# EAGLE design sandwich-logger (EAGLE 6.4)
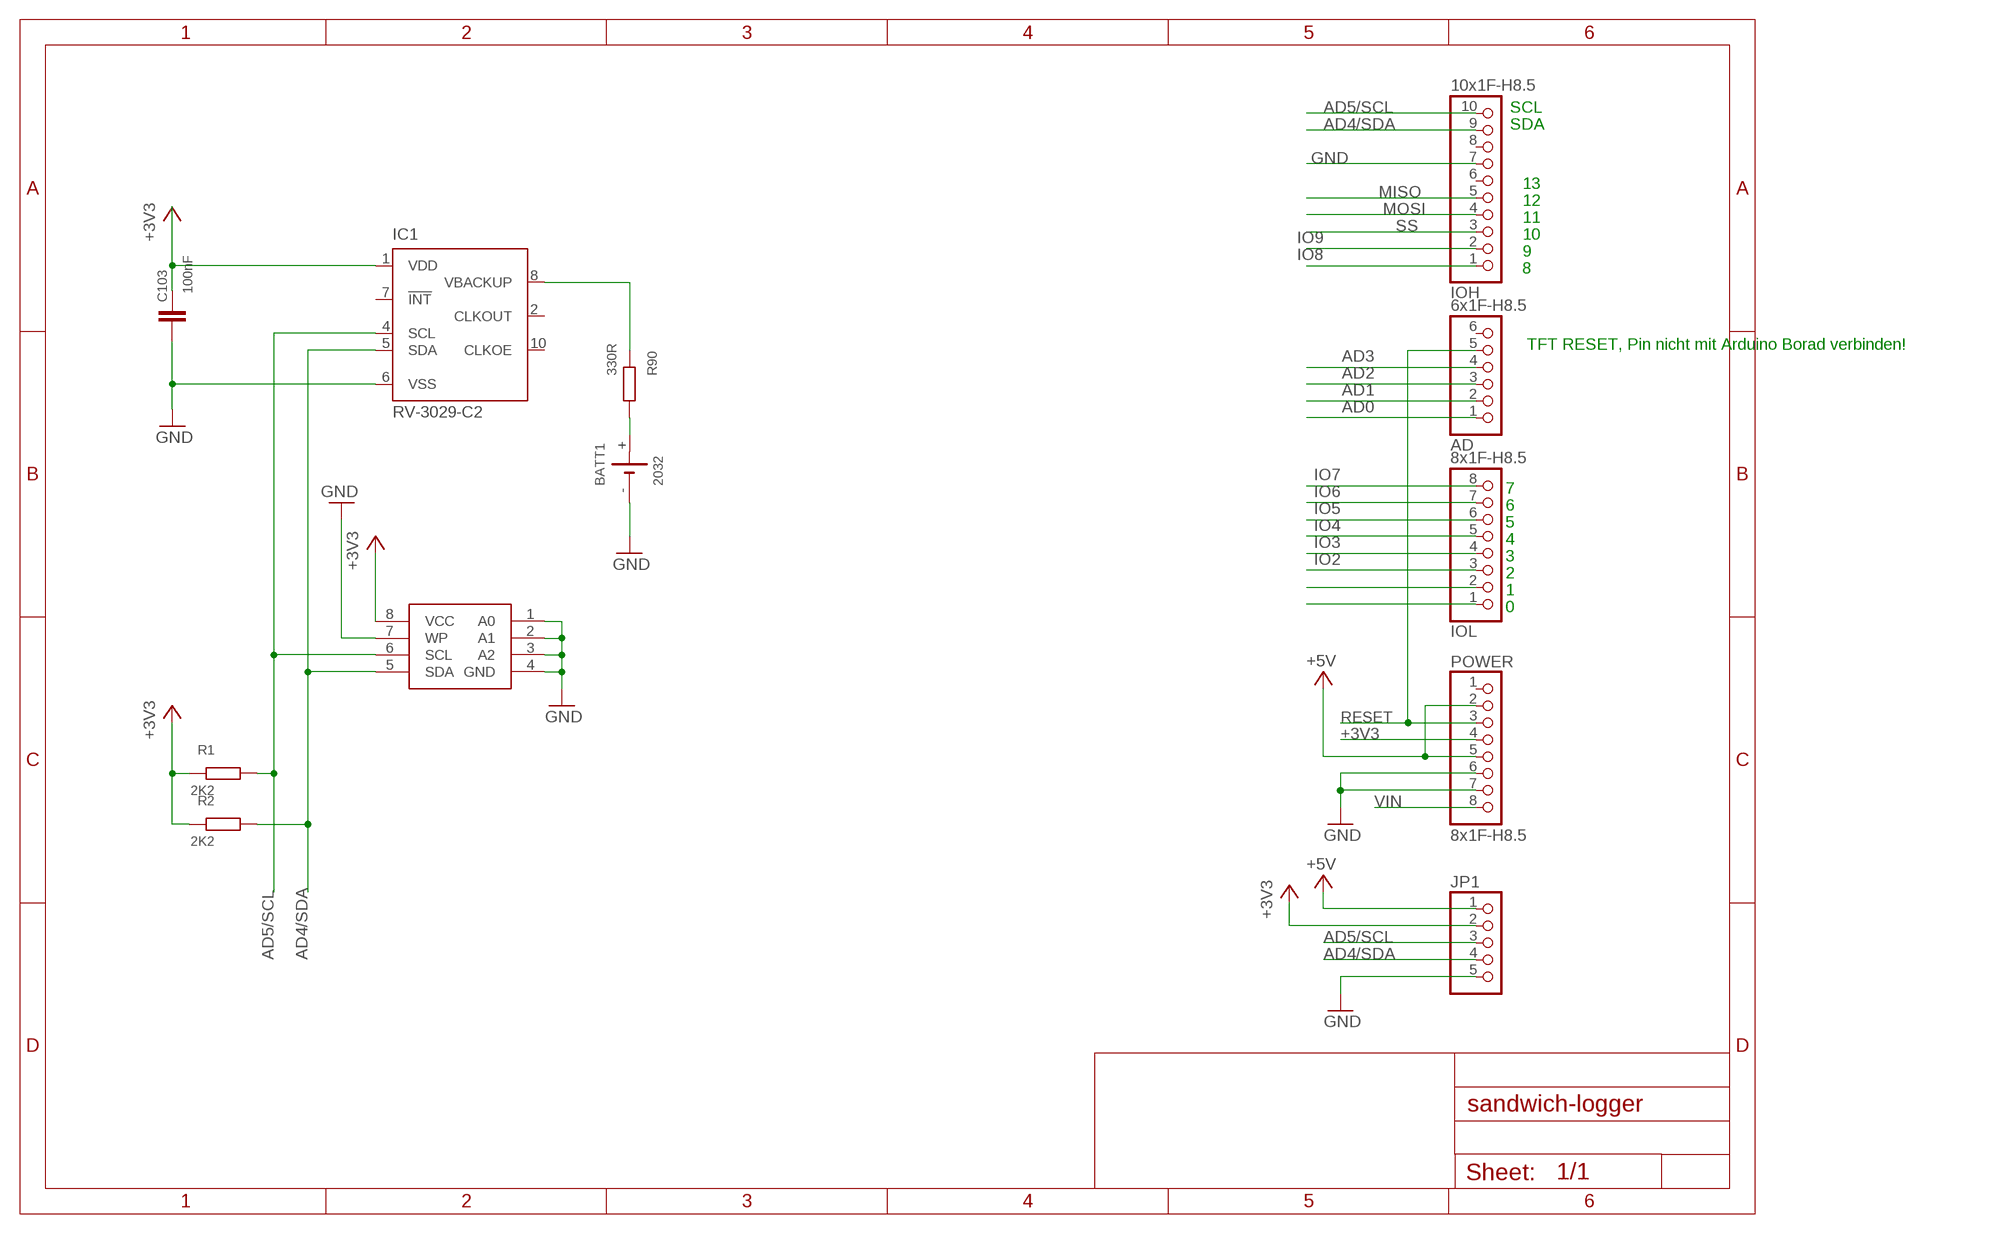
[diagram p0: schematic, sheet 1]

## Parts
AD  6x1F-H8.5  PINHD-1X6  [1X06]
BATT1  2032  CR2032_HOLDSMD  [2032_SMD]
C103  100nF  C-EUC0603  [C0603]
IC1  RV-3029-C2  [SON-10]
IC3  AT24C32  24C32  [SOIC08]
IOH  10x1F-H8.5  PINHD-1X10_ARD  [1X10]
IOL  8x1F-H8.5  PINHD-1X8  [1X08]
JP1  PINHD-1X5/90  [1X05/90]
POWER  8x1F-H8.5  PINHD-1X8  [1X08]
R1  2K2  R-EU_R0603  [R0603]
R2  2K2  R-EU_R0603  [R0603]
R90  330R  R-EU_R0603  [R0603]

## Nets
+3V3: C103.1 IC1.1(VDD) IC3.8(VCC) JP1.2 POWER.4 R1.2 R2.2
+5V [usbvcc]: JP1.1 POWER.2 POWER.5
AD0: AD.1
AD1: AD.2
AD2: AD.3
AD3: AD.4
AD4/SDA: IC1.5(SDA) IC3.5(SDA) IOH.9 JP1.4 R2.1
AD5/SCL: IC1.4(SCL) IC3.6(SCL) IOH.10 JP1.3 R1.1
GND [gnd]: BATT1.- C103.2 IC1.6(VSS) IC3.1(A0) IC3.2(A1) IC3.3(A2) IC3.4(GND) IC3.7(WP) IOH.7 JP1.5 POWER.6 POWER.7
IO2: IOL.3
IO3: IOL.4
IO4: IOL.5
IO5: IOL.6
IO6: IOL.7
IO7: IOL.8
IO8: IOH.1
IO9: IOH.2
MISO: IOH.5
MOSI: IOH.4
N$1: BATT1.+ R90.1
N$12: IC1.8(VBACKUP) R90.2
N$29: IOL.2
N$30: IOL.1
RESET: AD.5 POWER.3
SS: IOH.3
VIN [power]: POWER.8
Unconnected: AD.6 IC1.2(CLKOUT) IC1.7(!INT) IC1.10(CLKOE) IOH.6 IOH.8 POWER.1

## Notes on the sheet
- SCL
- SDA
- 13
- 12
- 11
- 10
- 9
- 8
- TFT RESET, Pin nicht mit Arduino Borad verbinden!
- 7
- 6
- 5
- 4
- 3
- 2
- 1
- 0

## Library data of the parts
AD = SmartPrj:PINHD-1X6: PIN HEADER
BATT1 = El_Mech:CR2032_HOLD: Batteriehalter 2032; BESCHREIBUNG: Batteriehalter SMD; HERSTELLER: z.B. Würth; HERST_NR: z.B. 795 271 41; SIZE: 2032
C103 = rcl:C-EU: CAPACITOR, European symbol; BESCHREIBUNG: Keramik Vielschichtkondensator; HERSTELLER: Div.; TK: X7R; TOL: 20%; VOLT: 16V
IC1 = crystal:RV-3029-C2: Highly accurate, DTCXO Temperature Compensated Real Time Clock / Calendar Module with I2C Interface. Source: Data shhet <http://www.mcrystal.ch/Resources/PDFs/DataSheet/Real-Time-Clocks/RV-3029-C2.aspx>
IC3 = PKJ:24C32
IOH = SmartPrj:PINHD-1X10_ARD: PIN HEADER
IOL POWER = SmartPrj:PINHD-1X8: PIN HEADER
JP1 = pinhead:PINHD-1X5: PIN HEADER
R1 R2 R90 = rcl:R-EU_: RESISTOR, European symbol; BESCHREIBUNG: Widerstand; HERSTELLER: Div.; LEISTUNG: 1/10W; TK: 100; TOL: 1%; VOLT: 50V

## Net classes
0 default: width 0.254 mm, clearance 0.254 mm
1 power: width 0.61 mm, drill 0.61 mm, clearance 0.254 mm
2 gnd: width 0.305 mm, drill 0.559 mm, clearance 0.254 mm
3 usbvcc: width 0.508 mm, drill 0.61 mm, clearance 0.254 mm
4 aref: width 0.406 mm, drill 0.61 mm, clearance 0.254 mm

## Board
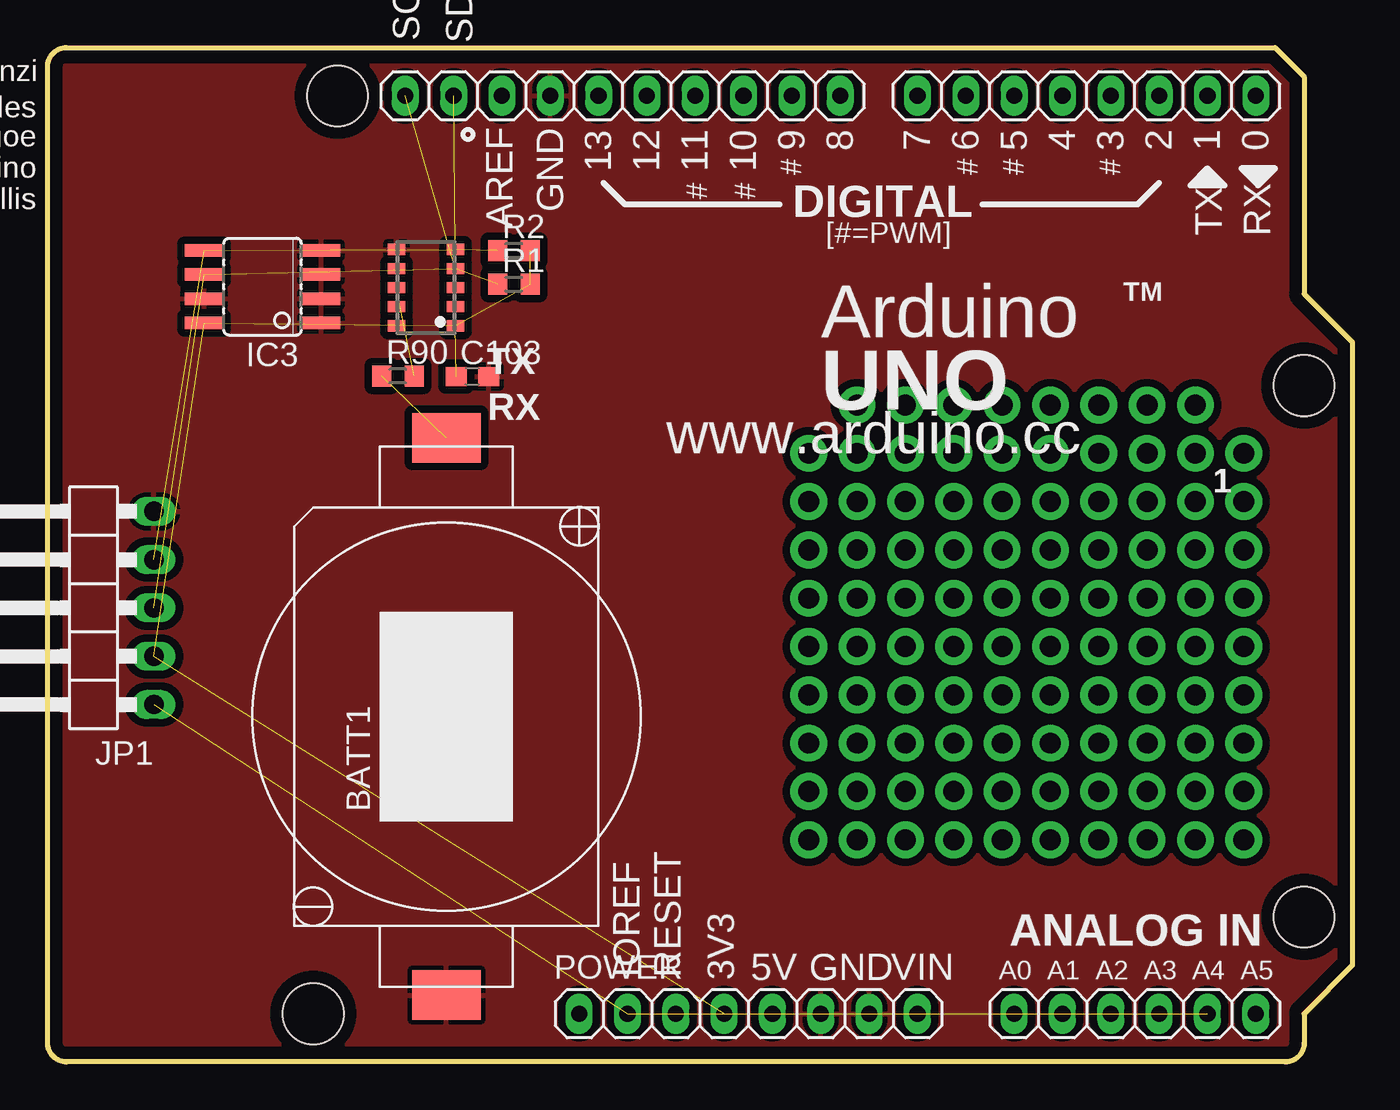
[diagram p1: board, top side]
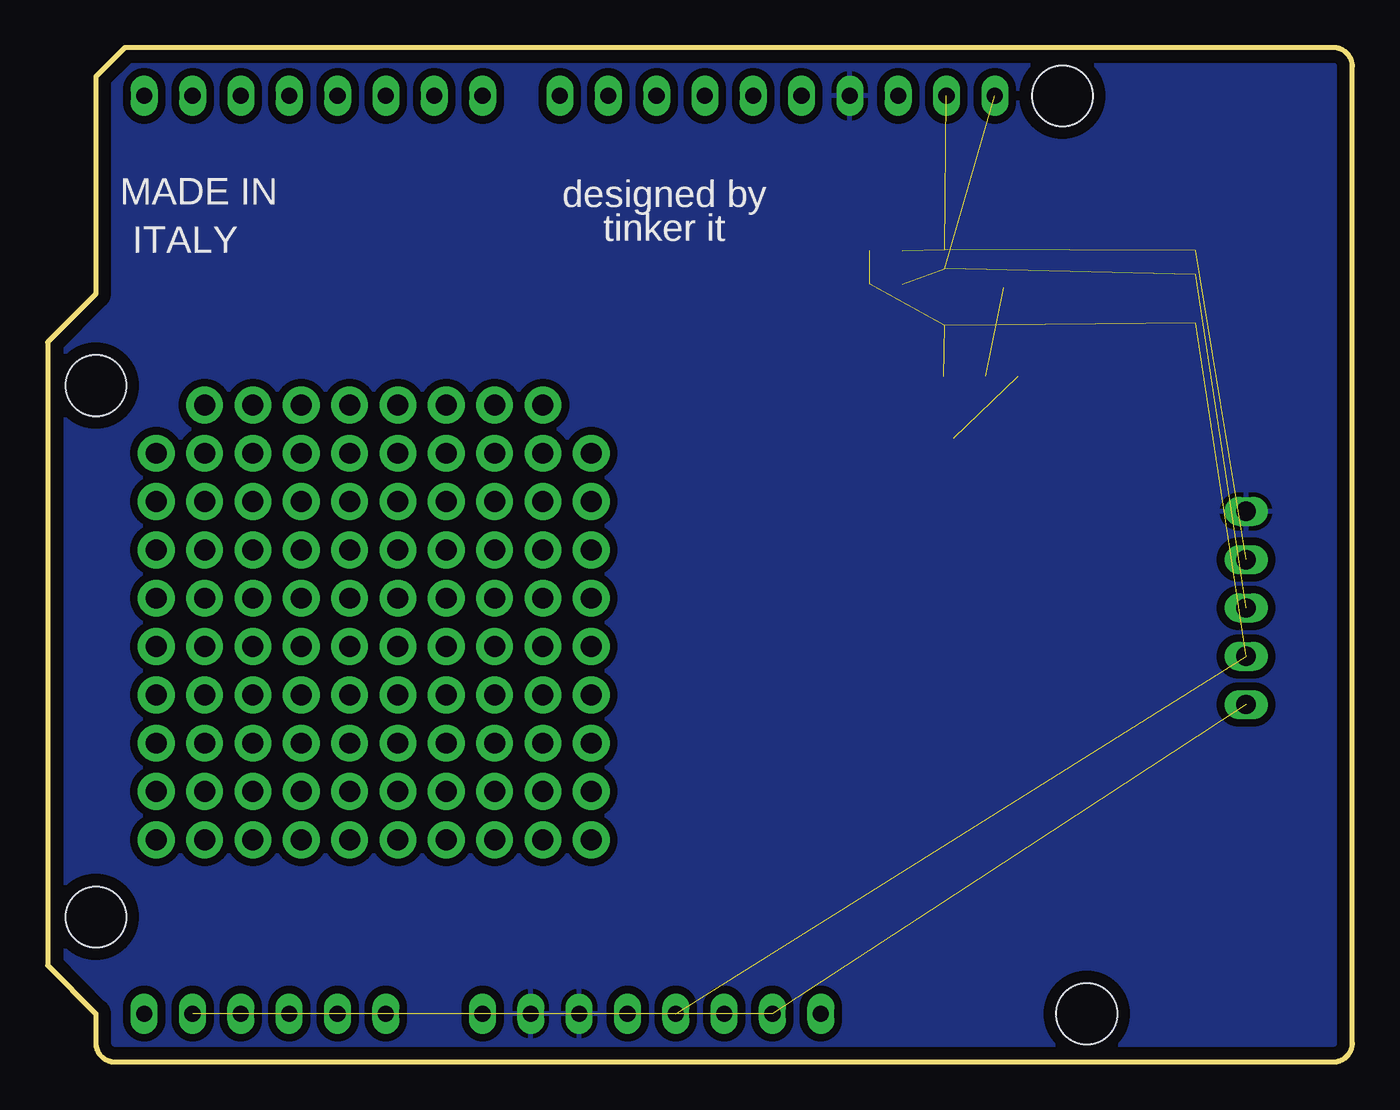
[diagram p2: board, bottom side, seen from below]

Size 68.58 x 53.34 mm. Coordinates in mm from the lower left corner, seen from the top.
Outline: 64.52,53.34 66.04,51.82 66.04,40.39 68.58,37.85 68.58,5.08 66.04,2.54 66.04,1 arc-90 65.04,0 1,0 arc-90 0,1 0,52.34 arc-90 1,53.34 64.52,53.34
Copper layers (1*16): Top 0.035mm / dielectric 1.5mm / Bottom 0.035mm
Design rules "default": minimum track width 10mil, minimum drill 22mil, track to track 10mil, track to pad 10mil, pad to pad 10mil, via to via 12mil, smd to smd 8mil, copper to edge 26mil, drill to drill 12mil, minimum pad ring 10mil, minimum via ring 10mil, stop-mask expansion 1mil, vias tented up to drill 30mil, thermal gap 10mil
Holes 3.2 mm at 66.04,35.56 66.04,7.62 15.24,50.8 13.97,2.54
vRestrict: area 22.9,44.1 to 24.6,49.1; area 25.4,45.5 to 27.1,49.1; area 28.4,45.3 to 29.6,48.8; area 31,45.3 to 32.1,48.8; area 33.5,45.3 to 34.7,48.8; area 36.1,45.3 to 37.2,48.8; area 38.7,47.2 to 39.9,48.8; area 40.3,45.1 to 47.6,46.9; area 60.3,44.2 to 61.7,46.7; area 62.9,44.2 to 64.3,46.7; area 61.3,35.8 to 64.8,37.2; area 0.6,21.8 to 2,30.1; 14 more areas

### Footprints (pad centres in the part's own frame; a part is rotated, then mirrored left to right if it is on the bottom)
1X06 = drill 0.85 pad 1.422 long: 1 -6.35,0; 2 -3.81,0; 3 -1.27,0; 4 1.27,0; 5 3.81,0; 6 6.35,0
2032_SMD = smd 3.6 x 2.6: + 0,-14.65; - 0,14.65
C0603 = smd 1.1 x 1: 1 -0.85,0; 2 0.85,0
SON-10 = smd 0.9 x 0.6: 1 -1.55,2; 2 -1.55,1; 3 -1.55,0; 4 -1.55,-1; 5 -1.55,-2; 6 1.55,-2; 7 1.55,-1; 8 1.55,0; 9 1.55,1; 10 1.55,2
SOIC08 = smd 0.66 x 2.032: 1 -1.905,-3.073; 2 -0.635,-3.073; 3 0.635,-3.073; 4 1.905,-3.073; 5 1.905,3.073; 6 0.635,3.073; 7 -0.635,3.073; 8 -1.905,3.073
1X10@1 = drill 0.85 pad 1.422 long: 1 -11.43,0; 2 -8.89,0; 3 -6.35,0; 4 -3.81,0; 5 -1.27,0; 6 1.27,0; 7 3.81,0; 8 6.35,0; 9 8.89,0; 10 11.43,0
1X08 = drill 0.85 pad 1.422 long: 1 -8.89,0; 2 -6.35,0; 3 -3.81,0; 4 -1.27,0; 5 1.27,0; 6 3.81,0; 7 6.35,0; 8 8.89,0
1X05/90 = drill 1.016 long: 1 -5.08,-3.81; 2 -2.54,-3.81; 3 0,-3.81; 4 2.54,-3.81; 5 5.08,-3.81
R0603 = smd 1 x 1.1: 1 -0.85,0; 2 0.85,0

### Placement (x,y rotation side)
AD  57.15,2.54 0 top
BATT1  20.95,18.16 180 top
C103  22.33,36.04 0 top
IC1  19.89,40.72 180 top
IC3  11.3,40.77 90 top
IOH  10x1F-H8.5  [1X10@1]  30.23,50.8 180 top
IOL  54.61,50.8 180 top
JP1  1.78,23.88 90 top
POWER  36.83,2.54 0 top
R1  24.51,40.89 0 top
R2  24.51,42.67 0 top
R90  18.41,36.07 0 top

### Tracks (layer width: path | path; a pad name or v marks a point on that pad's centre or on a via)
+3V3  (6 unrouted)
+5V  (2 unrouted)
AD4/SDA  (4 unrouted)
AD5/SCL  (4 unrouted)
GND
  pour Bottom (isolate 0.406, rank 2): 0.64,52.7 67.69,52.7 67.94,52.45 67.94,0.64 0.89,0.64 0.64,0.89 0.64,46.35
  pour Top (isolate 0.406, rank 2): 0.64,52.7 67.94,52.7 67.94,0.64 0.64,0.64 0.51,30.48 0.64,46.35
N$1  (1 unrouted)
N$2  (via drill 1.1 pad 1.93)
  other vias: 45.09,32
N$3  (via drill 1.1 pad 1.93)
  other vias: 42.55,32
N$4  (via drill 1.1 pad 1.93)
  other vias: 40.01,26.92
N$5  (via drill 1.1 pad 1.93)
  other vias: 45.09,34.54
N$6  (via drill 1.1 pad 1.93)
  other vias: 47.62,34.54
N$7  (via drill 1.1 pad 1.93)
  other vias: 42.55,34.54
N$8  (via drill 1.1 pad 1.93)
  other vias: 40.01,32
N$9  (via drill 1.1 pad 1.93)
  other vias: 50.16,34.54
N$10  (via drill 1.1 pad 1.93)
  other vias: 40.01,29.46
N$11  (via drill 1.1 pad 1.93)
  other vias: 52.7,32
N$12  (1 unrouted)
N$13  (via drill 1.1 pad 1.93)
  other vias: 57.78,29.46
N$14  (via drill 1.1 pad 1.93)
  other vias: 40.01,14.22
N$16  (via drill 1.1 pad 1.93)
  other vias: 52.7,34.54
N$19  (via drill 1.1 pad 1.93)
  other vias: 55.24,34.54
N$21  (via drill 1.1 pad 1.93)
  other vias: 57.78,26.92
N$22  (via drill 1.1 pad 1.93)
  other vias: 57.78,24.38
N$23  (via drill 1.1 pad 1.93)
  other vias: 57.78,21.84
N$24  (via drill 1.1 pad 1.93)
  other vias: 57.78,32
N$25  (via drill 1.1 pad 1.93)
  other vias: 55.24,32
N$26  (via drill 1.1 pad 1.93)
  other vias: 60.33,21.84
N$27  (via drill 1.1 pad 1.93)
  other vias: 50.16,32
N$28  (via drill 1.1 pad 1.93)
  other vias: 47.62,32
N$31  (via drill 1.1 pad 1.93)
  other vias: 42.55,29.46
N$32  (via drill 1.1 pad 1.93)
  other vias: 45.09,29.46
N$33  (via drill 1.1 pad 1.93)
  other vias: 47.62,29.46
N$34  (via drill 1.1 pad 1.93)
  other vias: 50.16,29.46
N$35  (via drill 1.1 pad 1.93)
  other vias: 52.7,29.46
N$36  (via drill 1.1 pad 1.93)
  other vias: 55.24,29.46
N$37  (via drill 1.1 pad 1.93)
  other vias: 57.78,11.68
N$38  (via drill 1.1 pad 1.93)
  other vias: 60.33,34.54
N$39  (via drill 1.1 pad 1.93)
  other vias: 62.87,21.84
N$40  (via drill 1.1 pad 1.93)
  other vias: 62.87,24.38
N$41  (via drill 1.1 pad 1.93)
  other vias: 60.33,14.22
N$42  (via drill 1.1 pad 1.93)
  other vias: 42.55,26.92
N$43  (via drill 1.1 pad 1.93)
  other vias: 45.09,26.92
N$44  (via drill 1.1 pad 1.93)
  other vias: 47.62,26.92
N$45  (via drill 1.1 pad 1.93)
  other vias: 50.16,26.92
N$46  (via drill 1.1 pad 1.93)
  other vias: 52.7,26.92
N$47  (via drill 1.1 pad 1.93)
  other vias: 55.24,26.92
N$48  (via drill 1.1 pad 1.93)
  other vias: 60.33,26.92
N$49  (via drill 1.1 pad 1.93)
  other vias: 60.33,11.68
N$50  (via drill 1.1 pad 1.93)
  other vias: 62.87,26.92
N$51  (via drill 1.1 pad 1.93)
  other vias: 50.16,11.68
N$52  (via drill 1.1 pad 1.93)
  other vias: 60.33,29.46
N$53  (via drill 1.1 pad 1.93)
  other vias: 62.87,11.68
N$54  (via drill 1.1 pad 1.93)
  other vias: 62.87,14.22
N$55  (via drill 1.1 pad 1.93)
  other vias: 60.33,24.38
N$56  (via drill 1.1 pad 1.93)
  other vias: 55.24,24.38
N$57  (via drill 1.1 pad 1.93)
  other vias: 52.7,24.38
N$58  (via drill 1.1 pad 1.93)
  other vias: 50.16,24.38
N$59  (via drill 1.1 pad 1.93)
  other vias: 47.62,24.38
N$60  (via drill 1.1 pad 1.93)
  other vias: 45.09,24.38
N$61  (via drill 1.1 pad 1.93)
  other vias: 42.55,24.38
N$62  (via drill 1.1 pad 1.93)
  other vias: 62.87,19.3
N$63  (via drill 1.1 pad 1.93)
  other vias: 62.87,16.76
N$64  (via drill 1.1 pad 1.93)
  other vias: 57.78,16.76
N$65  (via drill 1.1 pad 1.93)
  other vias: 60.33,19.3
N$66  (via drill 1.1 pad 1.93)
  other vias: 42.55,21.84
N$67  (via drill 1.1 pad 1.93)
  other vias: 45.09,21.84
N$68  (via drill 1.1 pad 1.93)
  other vias: 47.62,21.84
N$69  (via drill 1.1 pad 1.93)
  other vias: 50.16,21.84
N$70  (via drill 1.1 pad 1.93)
  other vias: 52.7,21.84
N$71  (via drill 1.1 pad 1.93)
  other vias: 55.24,21.84
N$72  (via drill 1.1 pad 1.93)
  other vias: 62.87,32
N$73  (via drill 1.1 pad 1.93)
  other vias: 62.87,29.46
N$74  (via drill 1.1 pad 1.93)
  other vias: 57.78,34.54
N$75  (via drill 1.1 pad 1.93)
  other vias: 55.24,11.68
N$76  (via drill 1.1 pad 1.93)
  other vias: 52.7,11.68
N$77  (via drill 1.1 pad 1.93)
  other vias: 45.09,11.68
N$78  (via drill 1.1 pad 1.93)
  other vias: 42.55,19.3
N$79  (via drill 1.1 pad 1.93)
  other vias: 45.09,19.3
N$80  (via drill 1.1 pad 1.93)
  other vias: 47.62,19.3
N$81  (via drill 1.1 pad 1.93)
  other vias: 50.16,19.3
N$82  (via drill 1.1 pad 1.93)
  other vias: 52.7,19.3
N$83  (via drill 1.1 pad 1.93)
  other vias: 55.24,19.3
N$84  (via drill 1.1 pad 1.93)
  other vias: 57.78,19.3
N$85  (via drill 1.1 pad 1.93)
  other vias: 42.55,11.68
N$86  (via drill 1.1 pad 1.93)
  other vias: 47.62,11.68
N$91  (via drill 1.1 pad 1.93)
  other vias: 60.33,16.76
N$92  (via drill 1.1 pad 1.93)
  other vias: 55.24,16.76
N$93  (via drill 1.1 pad 1.93)
  other vias: 52.7,16.76
N$94  (via drill 1.1 pad 1.93)
  other vias: 50.16,16.76
N$95  (via drill 1.1 pad 1.93)
  other vias: 47.62,16.76
N$96  (via drill 1.1 pad 1.93)
  other vias: 45.09,16.76
N$97  (via drill 1.1 pad 1.93)
  other vias: 42.55,16.76
N$102  (via drill 1.1 pad 1.93)
  other vias: 42.55,14.22
N$103  (via drill 1.1 pad 1.93)
  other vias: 45.09,14.22
N$104  (via drill 1.1 pad 1.93)
  other vias: 47.62,14.22
N$105  (via drill 1.1 pad 1.93)
  other vias: 50.16,14.22
N$106  (via drill 1.1 pad 1.93)
  other vias: 52.7,14.22
N$107  (via drill 1.1 pad 1.93)
  other vias: 55.24,14.22
N$109  (via drill 1.1 pad 1.93)
  other vias: 57.78,14.22
N$112  (via drill 1.1 pad 1.93)
  other vias: 40.01,24.38
N$113  (via drill 1.1 pad 1.93)
  other vias: 40.01,21.84
N$114  (via drill 1.1 pad 1.93)
  other vias: 40.01,19.3
N$115  (via drill 1.1 pad 1.93)
  other vias: 40.01,16.76
N$116  (via drill 1.1 pad 1.93)
  other vias: 40.01,11.68
N$117  (via drill 1.1 pad 1.93)
  other vias: 60.33,32
RESET  (1 unrouted)

### Text on the board
tPlace: 13 | 12 | 11 | 10 | 9 | 8 | 7 | 6 | 5 | 4 | 3 | 2 | 1 | 0
tNames: SCL | SDA | M.Banzi | D.Cuartielles | T.Igoe | AREF | GND | G.Martino | # | # | # | # | D.Mellis | # | # | DIGITAL | [#=PWM] | TX | RX | TM | TX | Arduino | RX | UNO | www.arduino.cc | 1 | ANALOG IN | IOREF | RESET | 3V3 | 5V | GND | VIN | A0 | A1 | A2 | A3 | A4 | A5
bNames: MADE IN | designed by | MADE IN | ITALY | tinker it | ITALY | designed by | tinker it | ATMEGA328
ReferenceLC: L | TX | ON | RX | PC1 | PC2
214bmp: D:/SmartProjects/Snc/a4_bn_logo2.bmp